# Altium schematic sheet 04_AIR724_PERIPHERAL.SchDoc
size A4
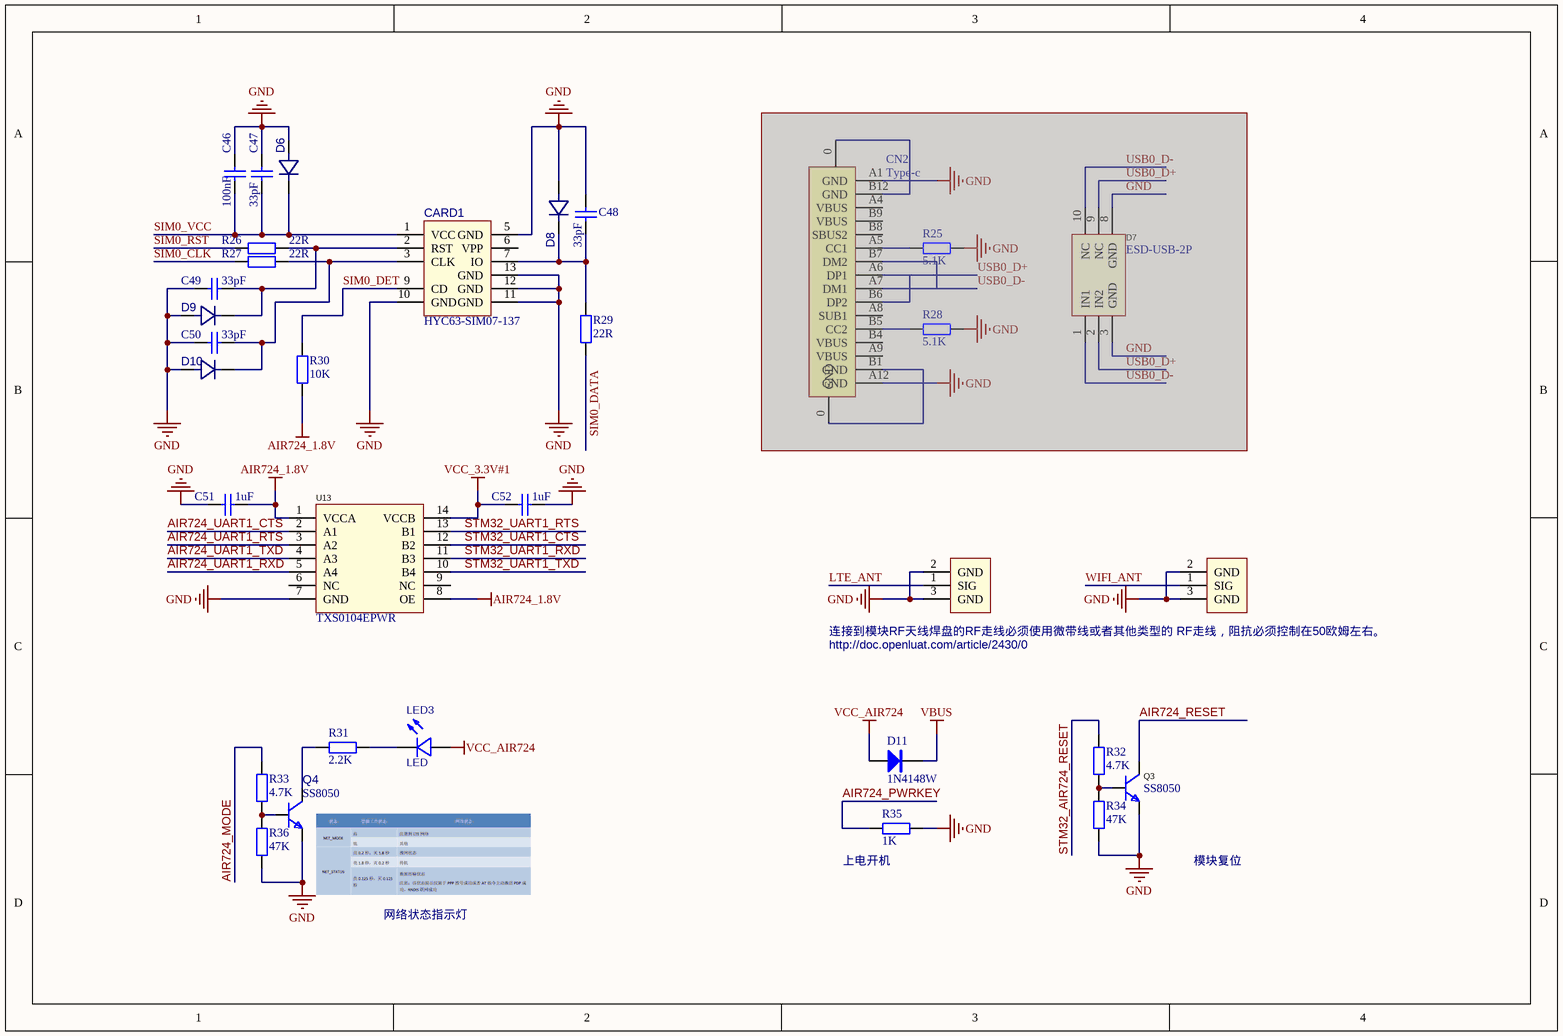
[diagram p0: 04_AIR724_PERIPHERAL.SchDoc]

## Parts
C46  100nF  [0603-C]
C47  33pF  [0603-C]
C48  33pF  [0603-C]
C49  33pF  [0603-C]
C50  33pF  [0603-C]
C51  1uF  [0603-C]
C52  1uF  [0603-C]
CARD1  HYC63-SIM07-137  [NANO-SIM-SMD_HYC63-SIM07-137]
CN2  Type-c  [Type-c 16pin]  (masked out: inside a compile mask, not in the netlist)
D6  ESD9X5.0ST5G  [ESD9X5.0ST5G]  (value not drawn)
D7  ESD-USB-2P  [SLP2510P8-2P]  (masked out: inside a compile mask, not in the netlist)
D8  ESD9X5.0ST5G  [ESD9X5.0ST5G]  (value not drawn)
D9  ESD9X5.0ST5G  [ESD9X5.0ST5G]  (value not drawn)
D10  ESD9X5.0ST5G  [ESD9X5.0ST5G]  (value not drawn)
D11  1N4148W  [1N4148W]
LED3  LED  [LED-0603]
Q3  SS8050  [SOT23-3M]
Q4  SS8050  [SOT23-3M]
R25  5.1K  [0603-R]  (masked out: inside a compile mask, not in the netlist)
R26  22R  [0603-R]
R27  22R  [0603-R]
R28  5.1K  [0603-R]  (masked out: inside a compile mask, not in the netlist)
R29  22R  [0603-R]
R30  10K  [0603-R]
R31  2.2K  [0603-R]
R32  4.7K  [0603-R]
R33  4.7K  [0603-R]
R34  47K  [0603-R]
R35  1K  [0603-R]
R36  47K  [0603-R]
RF1  IPEX  [IPEX-SMD-1代]  (value not drawn)
RF2  IPEX  [IPEX-SMD-1代]  (value not drawn)
U13  TXS0104EPWR  [TXS0104EPWR]

## Nets
AIR724_1.8V: C51.1 R30.1 U13.1(VCCA) U13.8(OE)
GND: C46.2 C47.2 C48.2 C49.2 C50.2 C51.2 C52.1 CARD1.5(GND) CARD1.10(GND) CARD1.11(GND) CARD1.12(GND) CARD1.13(GND) D6.2(A) D8.2(A) D9.2(A) D10.2(A) Q3.2(E) Q4.2(E) R34.1 R35.1 R36.1 RF1.2(GND) RF1.3(GND) RF2.2(GND) RF2.3(GND) U13.7(GND)
VBUS: D11.2(K)
VCC_3.3V#1: C52.2 U13.14(VCCB)
VCC_AIR724: D11.1(A) LED3.2(+)
AIR724_MODE: R33.2
AIR724_PWRKEY: R35.2
AIR724_RESET: Q3.3(C)
AIR724_UART1_CTS: U13.2(A1)
AIR724_UART1_RTS: U13.3(A2)
AIR724_UART1_RXD: U13.5(A4)
AIR724_UART1_TXD: U13.4(A3)
LTE_ANT: RF1.1(SIG)
SIM0_CLK: R27.1
SIM0_DATA: R29.1
SIM0_DET: CARD1.9(CD) R30.2
SIM0_RST: R26.1
SIM0_VCC: C46.1 C47.1 CARD1.1(VCC) D6.1(K)
STM32_AIR724_RESET: R32.2
STM32_UART1_CTS: U13.12(B2)
STM32_UART1_RTS: U13.13(B1)
STM32_UART1_RXD: U13.11(B3)
STM32_UART1_TXD: U13.10(B4)
WIFI_ANT: RF2.1(SIG)
NetC48_1: C48.1 CARD1.7(IO) D8.1(K) R29.2
NetC49_1: C49.1 CARD1.2(RST) D9.1(K) R26.2
NetC50_1: C50.1 CARD1.3(CLK) D10.1(K) R27.2
NetLED3_1: LED3.1(-) R31.1
NetQ3_1: Q3.1(B) R32.1 R34.2
NetQ4_1: Q4.1(B) R33.1 R36.2
NetQ4_3: Q4.3(C) R31.2

Not connected (* = marked no-connect by the designer): CARD1 6(VPP); U13 6(NC) 9(NC)

## Notes on the sheet
- (near RF1) 连接到模块RF天线焊盘的RF走线必须使用微带线或者其他类型的 RF走线，阻抗必须控制在50欧姆左右。
- (near RF1) http://doc.openluat.com/article/2430/0
- 网络状态指示灯
- (near R35) 上电开机
- 模块复位

## Library data of the parts
C46-C52 = C: 贴片电容; BOM名称: 无极性贴片电容; 联系卖家，免费查找封装: 唯一出售店铺网址https://shop463601444.taobao.com
CARD1 = NanoSIM卡座: 自弹式 NanoSIM卡 卡座 带CD PIN 带柱; Manufacturer: 华宇创; Add into BOM: yes; Body Height (Max): 1.25mm; Name: HYC63-SIM07-137; Symbol: HYC63-SIM07-137; Device: HYC63-SIM07-137; LCSC Part Name: 自弹式 NanoSIM卡 卡座 带CD PIN 带柱; Supplier Part: C645507; Manufacturer Part: HYC63-SIM07-137; Supplier Footprint: SMD; JLCPCB Part Class: Extended Part; Datasheet: https://atta.szlcsc.com/upload/public/pdf/source/20200616/C645507_89E3671A4105357B007331596DCB72F5.pdf; Supplier: LCSC; Convert to PCB: yes; Card Connection Mode: 自弹式; Card Type: NanoSIM卡; Connector Type: 卡座; Contact Material: -; Contact Plating: -; Operating Temperature Range: -20℃~+60℃
CN2 = Type-c: U262-161N-4BVC11
D6 D8-D10 = ESD9X5.0ST5G: Manufacturer: MSKSEMI(美森科); Symbol: ESD9X5.0ST5G_C3008066; Add into BOM: yes; Name: ESD9X5.0ST5G; Device: ESD9X5.0ST5G_C3008066; LCSC Part Name: ESD9X5.0ST5G; Supplier Part: C3008066; Manufacturer Part: ESD9X5.0ST5G; Supplier Footprint: SOD-923; JLCPCB Part Class: Extended Part; Datasheet: https://atta.szlcsc.com/upload/public/pdf/source/20220429/68E9B40153609821FAF30C4C48AA4713.pdf; Supplier: LCSC; Convert to PCB: yes
D7 = ESD-USB-2P: RClamp0522PATCT; Manufacturer: SEMTECH; Name: RClamp0524PATCT; Device: RClamp0524PATCT_C40960; Add into BOM: yes; Reverse Stand-Off Voltage (Vrwm): 5V; Breakdown Voltage (VBR): 6V; Clamping Voltage@Ipp: 15V; Peak Pulse Power(Ppp)@8/20us: 150W; Junction Capacitance(Cj)@1MHz: 0.8pF@1MHz; Symbol: RClamp0524PATCT; LCSC Part Name: RClamp0524PATCT; Supplier Part: C40960; Manufacturer Part: RClamp0524PATCT; Supplier Footprint: SLP2510P8; JLCPCB Part Class: Extended Part; Datasheet: https://atta.szlcsc.com/upload/public/pdf/source/20150124/1457707260739.pdf; Supplier: LCSC; Convert to PCB: yes; Operating Temperature: -55℃~+125℃@(Tj)
D11 = 1N4148W: 整流二极管; 版权归属: 源创客; BOM名称: 整流二极管; 学习资源: www.ooocke.com
LED3 = LED: BOM_Manufacturer: Wuxi ARK Tech Elec; BOM_Manufacturer Part: D-G060306G1-KS2; Contributor: LCSC; BOM_Supplier: LCSC; BOM_Supplier Part: C118334; BOM_JLCPCB Part Class: Extended Part; spicePre: L; spiceSymbolName: D-G060306G1-KS2
R25-R36 = R: 贴片电阻; 联系卖家，免费查找封装: 唯一出售店铺网址https://shop463601444.taobao.com; BOM名称: 贴片电阻
RF1 RF2 = IPEX: Manufacturer: BAT WIRELESS(蝙蝠无线); Name: BWIPX-1-001E; Add into BOM: yes; Connector Type: 板端; Interface Type: 内针; Frequency-Max: 6GHz; Number of Ports: 1; Impedance: 50Ω; Symbol: BWIPX-1-001E; Device: BWIPX-1-001E; LCSC Part Name: IPEX 内针 IPEX内针 天线座 IPEX-1 IPEX1 1代; Supplier Part: C496552; Manufacturer Part: BWIPX-1-001E; Supplier Footprint: SMD; JLCPCB Part Class: Extended Part; Datasheet: https://atta.szlcsc.com/upload/public/pdf/source/20201223/C496552_05E5A9956EAE1A8819C5051D085B1DED.pdf; Supplier: LCSC; Convert to PCB: yes; Interface Diameter: -; RF Series: IPEX; Style: -; Interface Length/Height: -; Operating Temperature Range: -
U13 = TXS0104EPWR: Manufacturer: TI(德州仪器); Add into BOM: yes; Channel Type: 双向; Number of Circuits: 1; Channels per Circuit: 4; Supply Voltage (VCCA): 1.65V~3.6V; Supply Voltage (VCCB): 2.3V~5.5V; Output Type: 推挽式；开路漏极; Data Rate: 24Mbps; Name: TXS0104EPWR; Symbol: TXS0104EPWR; Device: TXS0104EPWR; LCSC Part Name: TXS0104EPWR; Supplier Part: C44955; Manufacturer Part: TXS0104EPWR; Supplier Footprint: TSSOP-14; JLCPCB Part Class: Extended Part; Datasheet: https://www.ti.com/cn/lit/gpn/txs0104e; Supplier: LCSC; Convert to PCB: yes; Operating Temperature: -40℃~+85℃; Features: 自动方向检测